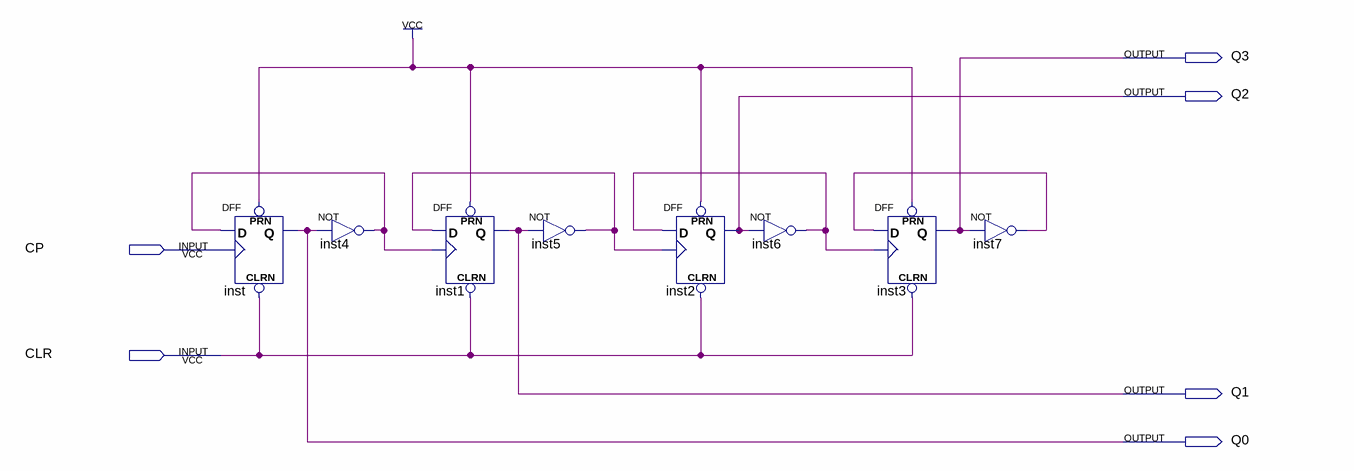
[diagram p0: schematic sheet]
// Quartus schematic counter.bdf as structural Verilog: 8 symbols, 6 pins
module counter (
  input  CP,
  input  CLR,
  output Q3,
  output Q2,
  output Q1,
  output Q0
);

  wire inst4_out, inst5_out, inst6_out, inst7_out;

  DFF inst (.CLRN(CLR), .CLK(CP), .D(inst4_out), .PRN(1'b1), .Q(Q0));
  not inst4 (inst4_out, Q0);
  DFF inst1 (.CLRN(CLR), .CLK(inst4_out), .D(inst5_out), .PRN(1'b1), .Q(Q1));
  not inst5 (inst5_out, Q1);
  DFF inst2 (.CLRN(CLR), .CLK(inst5_out), .D(inst6_out), .PRN(1'b1), .Q(Q2));
  not inst6 (inst6_out, Q2);
  DFF inst3 (.CLRN(CLR), .CLK(inst6_out), .D(inst7_out), .PRN(1'b1), .Q(Q3));
  not inst7 (inst7_out, Q3);
endmodule
